# EAGLE design LEDWithDriver (EAGLE 7.4.0)
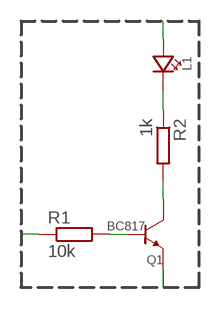
[diagram p0: schematic, sheet 1]

## Parts
L1  LED0603  [CHIPLED_0603]
Q1  BC817  TRANSISTOR-NPN-GENERICDEFAULT-SOT23-BEC  [SOT23]
R1  10k  R-EU_R0603  [R0603]
R2  1k  R-EU_R0603  [R0603]

## Nets
_VN: Q1.P$2(EMITTER)
_VP: L1.A
A: R1.1
INT: L1.C R2.1
N$1: Q1.P$3(COLLECTOR) R2.2
N$16: Q1.P$1(BASE) R1.2

## Library data of the parts
L1 = p.peter-leds:LED
Q1 = p.peter-gator:TRANSISTOR-NPN-GENERIC; SV_SPICE_MODEL: NPN (); SV_SPICE_ORDER: COLLECTOR;BASE;EMITTER; SV_SPICE_PREFIX: Q
R1 R2 = p.peter-gator:R-EU_: RESISTOR, European symbol; SV_SPICE_ORDER: 1;2; SV_SPICE_PREFIX: R

## Board
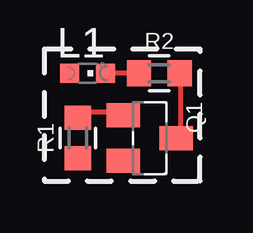
[diagram p1: board, top side]

No outline drawn. Coordinates in mm, seen from the top.
Copper layers (1*16): Top 0.035mm / dielectric 1.5mm / Bottom 0.035mm
Design rules "Fusion_eagle_rule_v1.1 *": minimum track width 6mil, minimum drill 12mil, track to track 6mil, track to pad 6mil, pad to pad 6mil, via to via 6mil, smd to smd 0mil, copper to edge 10mil, drill to drill 10mil, minimum pad ring 15mil, minimum via ring 6mil, stop-mask expansion 2mil, vias tented up to drill 100mil, thermal gap 10mil

### Footprints (pad centres in the part's own frame; a part is rotated, then mirrored left to right if it is on the bottom)
CHIPLED_0603 = smd 0.8 x 0.8: A 0,-0.75; C 0,0.75
SOT23 = smd 1 x 1.4: P$1 -0.95,-1.1; P$2 0.95,-1.1; P$3 0,1.1
R0603 = smd 1 x 1.1: 1 -0.85,0; 2 0.85,0

### Placement (x,y rotation side)
L1  1.8,4.5 270 top
Q1  4.4,1.8 270 top
R1  1.4,1.8 90 top
R2  4.8,4.5 0 top

### Tracks (layer width: path | path; a pad name or v marks a point on that pad's centre or on a via)
_VN
  Top 0.2: 3.5,0.65 Q1.P$2
A
  Top 0.2: 1.5,1 1.45,1.05 R1.1
INT
  Top 0.2: R2.1 L1.C
N$1
  Top 0.2: Q1.P$3 5.7,1.8 5.7,4.45 R2.2
N$16
  Top 0.2: R1.2 1.4,2.8 1.4,2.9 3.25,2.9 Q1.P$1